# EasyEDA Pro project ProPrj_智能车主控V5.0-20251108_2026-08-26.epro, board PCB2_1
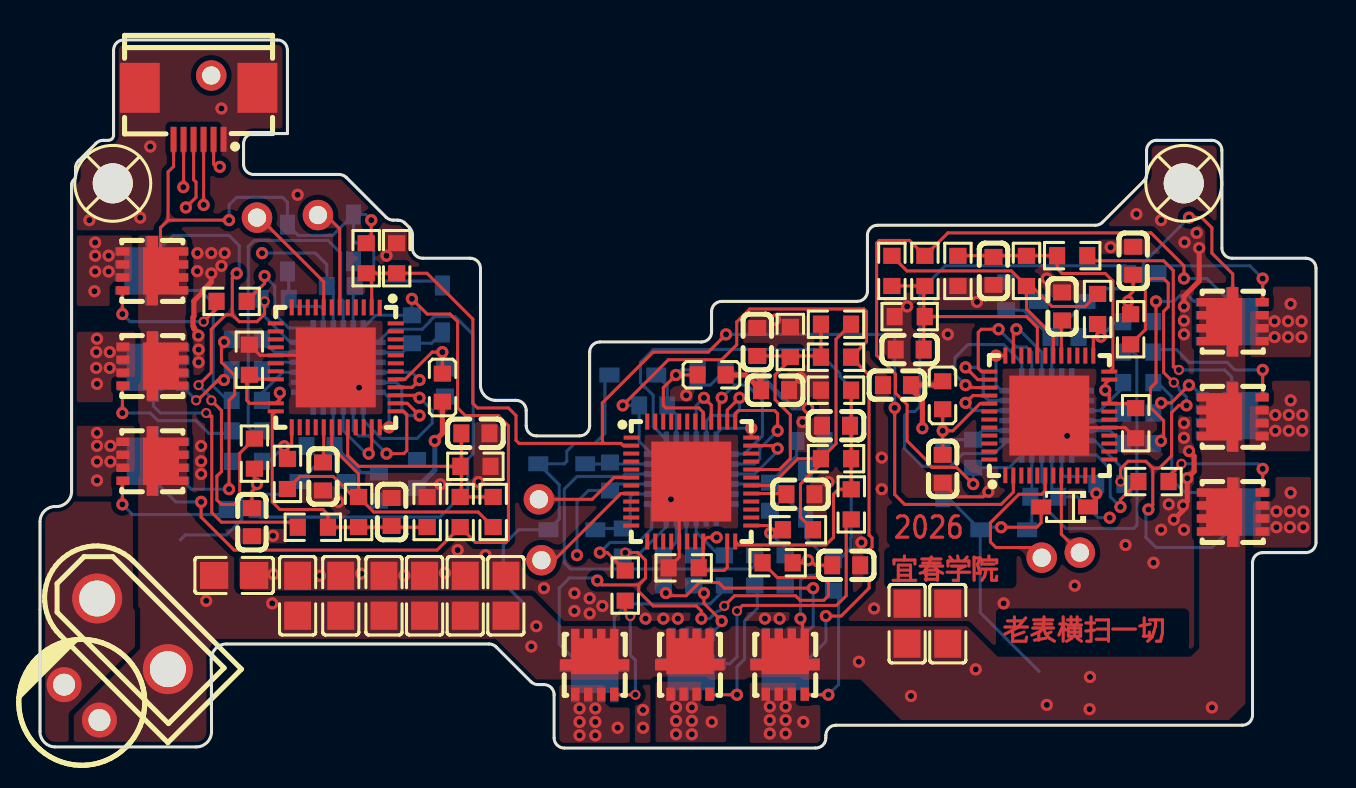
[diagram p7: board, top side]
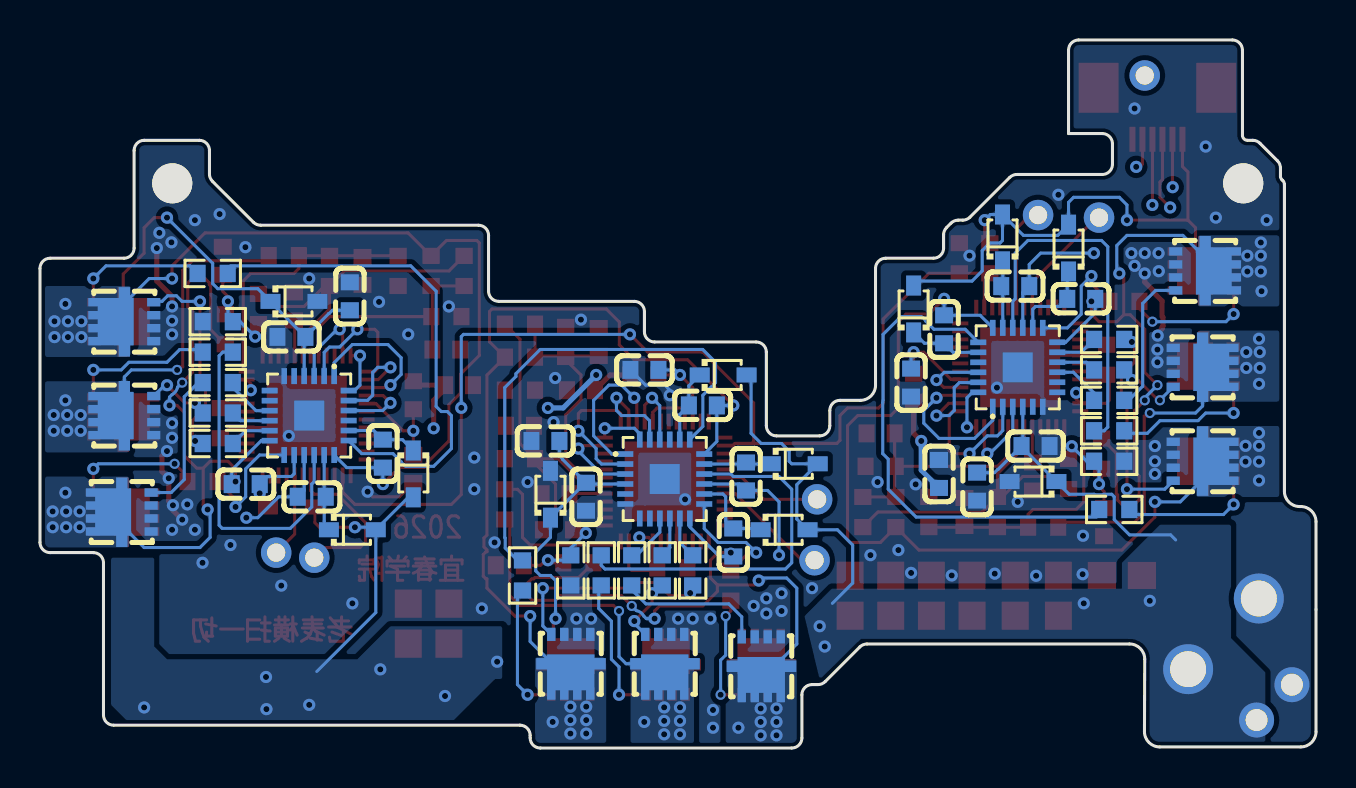
[diagram p8: board, bottom side, seen from below]

Outline 63.81 x 35.43 mm; copper layers: Top Layer, Inner1, Inner2, Bottom Layer. Coordinates in mm from the lower left corner of the outline.
Outline path: 0,11.32 0,0.82 arc(0.22,0.28) 0.76,0.06 7.82,0.06 arc(8.35,0.28) 8.58,0.82 8.56,4.45 arc(8.79,4.98) 9.33,5.21 22.45,5.21 arc(22.65,5.17) 22.81,5.06 24.54,3.32 arc(24.71,3.21) 24.9,3.17 25.2,3.17 arc(25.56,3.03) 25.71,2.67 25.71,0.51 arc(25.86,0.15) 26.22,0 38.79,0 arc(39.15,0.15) 39.3,0.51 39.3,0.64 arc(39.45,0.99) 39.81,1.14 60.13,1.14 arc(60.49,1.29) 60.63,1.65 60.63,9.27 arc(60.78,9.63) 61.14,9.78 63.3,9.78 arc(63.66,9.93) 63.81,10.29 63.81,24 arc(63.66,24.36) 63.3,24.51 59.61,24.51 arc(59.25,24.66) 59.1,25.02 59.1,29.9 arc(58.95,30.26) 58.6,30.41 55.84,30.41 arc(55.48,30.26) 55.33,29.9 55.33,28.72 arc(55.3,28.53) 55.19,28.36 53.13,26.31 arc(52.97,26.2) 52.77,26.16 41.89,26.16 arc(41.53,26.01) 41.38,25.65 41.38,22.86 arc(41.23,22.5) 40.87,22.35 34.09,22.35 arc(33.73,22.2) 33.58,21.84 33.58,20.83 arc(33.43,20.47) 33.08,20.32 28,20.32 arc(27.64,20.17) 27.49,19.81 27.49,16.13 arc(27.34,15.77) 26.98,15.62 24.82,15.62 arc(24.46,15.77) 24.31,16.13 24.31,16.89 arc(24.16,17.25) 23.8,17.4 22.79,17.4 arc(22.25,17.62) 22.03,18.16 22.03,24 arc(21.88,24.36) 21.52,24.51 19.13,24.51 arc(18.77,24.66) 18.62,25.02 18.62,25.69 arc(18.58,25.88) 18.47,26.05 18.25,26.27 arc(18.09,26.38) 17.89,26.42 17.67,26.42 arc(17.47,26.45) 17.31,26.56 15.32,28.55 arc(15.15,28.66) 14.96,28.7 10.69,28.7 arc(10.33,28.85) 10.18,29.21 10.18,30.24 arc(10.33,30.6) 10.69,30.75 12.37,30.75 12.37,34.92 arc(12.23,35.28) 11.87,35.43 4.19,35.43 arc(3.83,35.28) 3.68,34.92 3.68,30.67 arc(3.6,30.49) 3.42,30.41 3.16,30.41 arc(2.97,30.37) 2.8,30.26 1.93,29.39 arc(1.82,29.22) 1.78,29.03 1.78,28.62 arc(1.76,28.52) 1.7,28.44 1.65,28.39 arc(1.6,28.3) 1.58,28.21 1.58,12.85 arc(1.36,12.31) 0.82,12.09 0.76,12.09 arc(0.22,11.86) 0,11.32
Stack: Top Layer 0.035mm Outer layer thickness 1oz / Dielectric1 0.2104mm 7628 RC49% 8.6mil / Inner1 0.0152mm Inner layer thickness / Dielectric2 1.065mm 1.1mm H/HOZ Copper / Inner2 0.0152mm Inner layer thickness / Dielectric3 0.2104mm 7628 RC49% 8.6mil / Bottom Layer 0.035mm Outer layer thickness 1oz

## Design rules (mm)
spacing copperThickness1oz (default): track to track 0.102, other pairs 0.152 to 0.3
spacing copperThickness2oz: track to track 0.203, other pairs 0.152 to 0.3
track width copperThickness1oz (default): min 0.127, default 0.254, max 2.54
track width copperThickness2oz: min 0.203, default 0.254, max 2.54
differential pair differentialPair (default): width min 0.127, default 0.254, max 2.54; gap min 0.152, default 0.152
net VS13 uses copperRegion
net GND uses copperRegion
net VIN uses copperRegion

## Placement (name value [footprint] x y rotation side)
C1  100nF  [C0603]  14.15 13.59 270 top
C2  100nF  [C0603]  21.77 15.75 180 top
C3  100nF  [C0603]  20.25 18.29 90 bottom
C4  100nF  [C0603]  45.14 13.97 90 top
C5  100nF  [C0603]  17.58 11.81 270 top
C6  100nF  [C0603]  10.6 11.3 90 top
C7  100nF  [C0603]  43.49 19.94 0 top
C8  100nF  [C0603]  51.11 22.1 90 top
C9  10uF  [C0603]  16.95 13.08 90 bottom
C10  100nF  [C0603]  14.03 15.11 0 bottom
C11  10uF  [C0603]  18.6 20.95 90 bottom
C12  10uF  [C0603]  15.04 23.11 180 bottom
C13  10uF  [C0603]  11.74 22.48 180 bottom
C14  100nF  [C0603]  47.68 23.88 90 top
C15  100nF  [C0603]  54.67 24.38 270 top
C16  10uF  [C0603]  48.32 22.61 270 bottom
C17  100nF  [C0603]  51.24 20.57 180 bottom
C18  10uF  [C0603]  46.66 14.73 270 bottom
C19  10uF  [C0603]  50.22 12.57 0 bottom
C20  10uF  [C0603]  53.52 13.21 0 bottom
C21  100nF  [C0603]  33.58 18.92 180 bottom
C22  100nF  [C0603]  35.87 20.32 270 top
C23  100nF  [C0603]  38.03 12.7 0 top
C24  100nF  [C0603]  39.81 16.13 0 top
C25  100nF  [C0603]  40.31 9.14 180 top
C26  10uF  [C0603]  38.54 15.37 180 bottom
C27  100nF  [C0603]  36.5 12.57 90 bottom
C28  10uF  [C0603]  30.66 17.14 180 bottom
C29  10uF  [C0603]  28.5 13.59 270 bottom
C30  10uF  [C0603]  29.14 10.29 270 bottom
C31  22uF  [C0805]  19.23 7.62 270 top
C32  22uF  [C0805]  15.04 7.62 270 top
C33  22uF  [C0805]  23.3 7.62 270 top
C34  22uF  [C0805]  43.36 6.22 270 top
C35  22uF  [C0805]  17.2 7.62 270 top
C36  22uF  [C0805]  12.88 7.62 270 top
C37  22uF  [C0805]  9.71 8.64 180 top
C38  22uF  [C0805]  21.26 7.62 270 top
C39  22uF  [C0805]  45.39 6.22 270 top
C41  470uF  [CAP-TH_BD6.3-P2.50-D0.6-FD]  2.09 2.29 135 top
C42  1uF  [C0603]  18.85 13.72 90 bottom
C44  1uF  [C0603]  42.85 18.16 0 top
C45  1uF  [C0603]  36.76 17.91 180 top
CN1  XT30UPB-M  [CONN-TH_XT30UPB-M]  4.63 5.72 315 top
D1  CESD12VD3 ZC  [SOD-323_L1.8-W1.3-LS2.5-RD]  14.15 13.34 0 bottom
D2  B5819WS  [SOD-323_L1.8-W1.3-LS2.5-RD]  20.12 21.97 90 bottom
D3  B5819WS  [SOD-323_L1.8-W1.3-LS2.5-RD]  15.68 25.53 90 bottom
D4  B5819WS  [SOD-323_L1.8-W1.3-LS2.5-RD]  12.37 25.02 90 bottom
D6  CESD12VD3 ZC  [SOD-323_L1.8-W1.3-LS2.5-RD]  51.11 22.35 180 bottom
D7  B5819WS  [SOD-323_L1.8-W1.3-LS2.5-RD]  45.14 13.72 270 bottom
D8  B5819WS  [SOD-323_L1.8-W1.3-LS2.5-RD]  48.19 10.92 180 bottom
D9  B5819WS  [SOD-323_L1.8-W1.3-LS2.5-RD]  51.24 12.06 180 top
D11  CESD12VD3 ZC  [SOD-323_L1.8-W1.3-LS2.5-RD]  38.28 12.7 90 bottom
D12  B5819WS  [SOD-323_L1.8-W1.3-LS2.5-RD]  29.65 18.67 180 bottom
D13  B5819WS  [SOD-323_L1.8-W1.3-LS2.5-RD]  26.09 14.22 180 bottom
D14  B5819WS  [SOD-323_L1.8-W1.3-LS2.5-RD]  26.6 10.92 180 bottom
FPC1  FPC-05F-6PH20  [FPC-SMD_6P-P0.50_XUNPU_FPC-05F-6PH20]  7.93 31.75 180 top
L1  BLM18EG221SN1D  [L0603]  20.12 18.03 270 top
L2  BLM18EG221SN1D  [L0603]  45.14 17.65 90 top
L3  BLM18EG221SN1D  [L0603]  33.58 18.67 0 top
NOREF  -  [Pad_e715]  13.9 26.67 0 top
NOREF#2  -  [Pad_e1759]  8.56 33.66 0 top
NOREF#3  -  [Pad_e714]  10.85 26.54 0 top
NOREF#4  -  [Pad_e1275]  25.07 9.4 90 top
NOREF#5  -  [Pad_e1276]  24.95 12.45 90 top
NOREF#6  -  [Pad_e968]  50.09 9.53 180 top
NOREF#7  -  [Pad_e1506]  52 9.78 180 top
Q1  NVTFS4C05NWFTAG  [WDFN-5_L3.3-W3.3-P0.65-BL]  4.88 14.35 270 top
Q2  NVTFS4C05NWFTAG  [WDFN-5_L3.3-W3.3-P0.65-BL]  4.88 19.11 270 top
Q3  NVTFS4C05NWFTAG  [WDFN-5_L3.3-W3.3-P0.65-BL]  4.88 23.88 270 top
Q4  NVTFS4C05NWFTAG  [WDFN-5_L3.3-W3.3-P0.65-BL]  6.41 14.35 270 bottom
Q5  NVTFS4C05NWFTAG  [WDFN-5_L3.3-W3.3-P0.65-BL]  6.41 19.05 270 bottom
Q6  NVTFS4C05NWFTAG  [WDFN-5_L3.3-W3.3-P0.65-BL]  6.28 23.88 270 bottom
Q7  NVTFS4C05NWFTAG  [WDFN-5_L3.3-W3.3-P0.65-BL]  60.38 21.34 90 top
Q8  NVTFS4C05NWFTAG  [WDFN-5_L3.3-W3.3-P0.65-BL]  60.38 16.57 90 top
Q9  NVTFS4C05NWFTAG  [WDFN-5_L3.3-W3.3-P0.65-BL]  60.38 11.81 90 top
Q10  NVTFS4C05NWFTAG  [WDFN-5_L3.3-W3.3-P0.65-BL]  58.86 21.34 90 bottom
Q11  NVTFS4C05NWFTAG  [WDFN-5_L3.3-W3.3-P0.65-BL]  58.86 16.64 90 bottom
Q12  NVTFS4C05NWFTAG  [WDFN-5_L3.3-W3.3-P0.65-BL]  58.98 11.81 90 bottom
Q13  NVTFS4C05NWFTAG  [WDFN-5_L3.3-W3.3-P0.65-BL]  37.27 3.43 0 top
Q14  NVTFS4C05NWFTAG  [WDFN-5_L3.3-W3.3-P0.65-BL]  32.5 3.43 0 top
Q15  NVTFS4C05NWFTAG  [WDFN-5_L3.3-W3.3-P0.65-BL]  27.74 3.43 0 top
Q16  NVTFS4C05NWFTAG  [WDFN-5_L3.3-W3.3-P0.65-BL]  37.27 4.95 0 bottom
Q17  NVTFS4C05NWFTAG  [WDFN-5_L3.3-W3.3-P0.65-BL]  32.57 4.95 0 bottom
Q18  NVTFS4C05NWFTAG  [WDFN-5_L3.3-W3.3-P0.65-BL]  27.74 4.83 0 bottom
R1  10K  [R0603]  10.47 19.43 270 top
R2  1kΩ  [R0603]  19.36 11.81 270 top
R3  1kΩ  [R0603]  10.34 14.35 0 bottom
R4  5.1kΩ  [R0603]  21.01 11.81 270 top
R5  1kΩ  [R0603]  22.66 11.81 270 top
R6  5.1kΩ  [R0603]  13.64 11.05 180 top
R7  1kΩ  [R0603]  15.93 11.81 90 top
R8  5.1kΩ  [R0603]  10.72 14.73 90 top
R9  1kΩ  [R0603]  12.37 13.72 270 top
R10  1kΩ  [R0603]  21.77 14.1 180 top
R11  10kΩ  [R0603]  17.84 24.51 270 top
R12  47kΩ  [R0603]  16.31 24.51 90 top
R13  10K  [R0603]  54.79 16.26 90 top
R14  4.7Ω  [R0603]  10.09 11.94 180 bottom
R15  4.7Ω  [R0603]  10.34 15.88 180 bottom
R16  4.7Ω  [R0603]  9.58 22.35 180 top
R17  4.7Ω  [R0603]  10.34 17.4 180 bottom
R18  4.7Ω  [R0603]  10.34 18.92 180 bottom
R19  4.7Ω  [R0603]  10.34 20.45 180 bottom
R20  1kΩ  [R0603]  45.9 23.88 90 top
R21  1kΩ  [R0603]  54.92 21.34 180 bottom
R22  5.1kΩ  [R0603]  44.25 23.88 90 top
R23  1kΩ  [R0603]  42.6 23.88 90 top
R24  5.1kΩ  [R0603]  51.62 24.64 0 top
R25  1kΩ  [R0603]  49.33 23.88 270 top
R26  5.1kΩ  [R0603]  54.54 20.95 270 top
R27  1kΩ  [R0603]  52.89 21.97 90 top
R28  1kΩ  [R0603]  43.49 21.59 0 top
R29  10K  [R0603]  32.19 9.02 0 top
R30  1kΩ  [R0603]  39.81 17.91 0 top
R31  4.7Ω  [R0603]  55.17 23.75 0 bottom
R32  4.7Ω  [R0603]  54.92 19.81 0 bottom
R33  4.7Ω  [R0603]  55.68 13.34 0 top
R34  4.7Ω  [R0603]  54.92 18.29 0 bottom
R35  4.7Ω  [R0603]  54.92 16.76 0 bottom
R36  4.7Ω  [R0603]  54.92 15.24 0 bottom
R37  1kΩ  [R0603]  37.27 8.89 90 bottom
R38  5.1kΩ  [R0603]  39.81 19.56 0 top
R39  1kΩ  [R0603]  39.81 21.21 0 top
R40  5.1kΩ  [R0603]  40.57 12.19 270 top
R41  1kΩ  [R0603]  39.81 14.48 180 top
R42  5.1kΩ  [R0603]  36.89 9.27 180 top
R43  1kΩ  [R0603]  37.9 10.92 0 top
R44  1kΩ  [R0603]  37.52 20.32 270 top
R45  4.7Ω  [R0603]  39.68 8.64 270 bottom
R46  4.7Ω  [R0603]  35.74 8.89 270 bottom
R47  4.7Ω  [R0603]  29.27 8.13 270 top
R48  4.7Ω  [R0603]  34.22 8.89 270 bottom
R49  4.7Ω  [R0603]  32.69 8.89 270 bottom
R50  4.7Ω  [R0603]  31.17 8.89 270 bottom
SCREW1  -  [M2螺丝]  3.64 28.26 0 top
SCREW2  -  [M2螺丝]  57.2 28.26 0 top
U1  AI8051U-34K64-QFN48  [UQFN-48_L6.0-W6.0-P0.40-BL-EP4.4]  14.79 19.05 180 top
U2  FD6288Q  [QFN-24_L4.0-W4.0-P0.50-BL-EP2.6]  14.91 19.05 180 bottom
U3  AI8051U-34K64-QFN48  [UQFN-48_L6.0-W6.0-P0.40-BL-EP4.4]  50.47 16.64 0 top
U4  FD6288Q  [QFN-24_L4.0-W4.0-P0.50-BL-EP2.6]  50.35 16.64 0 bottom
U5  AI8051U-34K64-QFN48  [UQFN-48_L6.0-W6.0-P0.40-BL-EP4.4]  32.57 13.34 270 top
U6  FD6288Q  [QFN-24_L4.0-W4.0-P0.50-BL-EP2.6]  32.57 13.46 270 bottom

## Footprints (pads in the part's own frame, mm; a bottom-side part is the same pattern mirrored in y, then rotated)
C0603
  rect 0.8x0.9 smd: 1(-0.7,0) 2(0.7,0)
C0805
  rect 1.41x1.35 smd: 1(-1,0) 2(1,0)
CAP-TH_BD6.3-P2.50-D0.6-FD
  round 1.75 hole 1.1: 1(-1.25,0) 2(1.25,0)
CONN-TH_XT30UPB-M
  round 2.5 hole 1.8: 1(-2.5,0) 2(2.5,0)
FPC-SMD_6P-P0.50_XUNPU_FPC-05F-6PH20
  rect 0.3x1.25 smd: 1(-1.25,1.288) 2(-0.75,1.288) 3(-0.25,1.288) 4(0.25,1.288) 5(0.75,1.288) 6(1.25,1.288)
  rect 2x2.5 smd: 7(2.94,-1.288) 8(-2.94,-1.288)
L0603
  rect 0.8x0.864 smd: 1(-0.7,0) 2(0.7,0)
M2螺丝
  round 2 hole 2: 1(0,0)
Pad_e714
  round 1.524 hole 0.914: 1(0,0)
Pad_e715
  round 1.524 hole 0.914: 2(0,0)
Pad_e968
  round 1.524 hole 0.914: 2(0,0)
Pad_e1275
  round 1.524 hole 0.914: 1(0,0)
Pad_e1276
  round 1.524 hole 0.914: 2(0,0)
Pad_e1506
  round 1.524 hole 0.914: 2(0,0)
Pad_e1759
  round 1.524 hole 0.914: 1(0,0)
QFN-24_L4.0-W4.0-P0.50-BL-EP2.6
  rect 0.28x0.8 smd: 1(-1.25,-1.975) 2(-0.75,-1.975) 3(-0.25,-1.975) 4(0.25,-1.975) 5(0.75,-1.975) 6(1.25,-1.975) 13(1.25,1.975) 14(0.75,1.975) 15(0.25,1.975) 16(-0.25,1.975) 17(-0.75,1.975) 18(-1.25,1.975)
  rect 0.8x0.28 smd: 7(1.975,-1.25) 8(1.975,-0.745) 9(1.975,-0.245) 10(1.975,0.255) 11(1.975,0.755) 12(1.975,1.255) 19(-1.975,1.25) 20(-1.975,0.75) 21(-1.975,0.25) 22(-1.975,-0.25) 23(-1.975,-0.75) 24(-1.975,-1.25)
  rect 1.5x1.5 smd: 25(0,0)
R0603
  rect 0.806x0.864 smd: 1(-0.753,0) 2(0.753,0)
SOD-323_L1.8-W1.3-LS2.5-RD
  rect 1x0.75 smd: 1(-1.173,0) 2(1.173,0)
UQFN-48_L6.0-W6.0-P0.40-BL-EP4.4
  rect 0.2x0.8 smd: 1(-2.2,-2.981) 2(-1.8,-3) 3(-1.4,-3) 4(-1,-3) 5(-0.6,-3) 6(-0.2,-3) 7(0.2,-3) 8(0.6,-3) 9(1,-3) 10(1.4,-3) 11(1.8,-3) 12(2.2,-3) 25(2.2,3) 26(1.8,3) 27(1.4,3) 28(1,3) 29(0.6,3) 30(0.2,3) 31(-0.2,3) 32(-0.6,3) 33(-1,3) 34(-1.4,3) 35(-1.8,3) 36(-2.2,3)
  rect 0.8x0.2 smd: 13(3,-2.199) 14(3,-1.8) 15(3,-1.4) 16(3,-1) 17(3,-0.6) 18(3,-0.2) 19(3,0.2) 20(3,0.6) 23(3,1.8) 24(3,2.2) 37(-3,2.2) 38(-3,1.8) 39(-3,1.4) 40(-3,1) 41(-3,0.6) 42(-3,0.2) 43(-3,-0.2) 44(-3,-0.6) 45(-3,-1) 46(-3,-1.4) 47(-3,-1.8) 48(-3,-2.199)
  rect 4x4 smd: 49(-0.002,0.002)
WDFN-5_L3.3-W3.3-P0.65-BL
  rect 0.42x0.66 smd: 1(-0.975,-0.735) 2(-0.325,-0.735) 3(0.325,-0.735) 4(0.975,-0.735)
  custom 3.48x2.265 smd: 5(0,0.735)

## Nets
As in the schematic, except:
VCC_5V: C42.1 C44.2 C45.2 FPC1.2 L1.2 L2.2 L3.2 NOREF#2.1
RX1: NOREF.2 U1.6
RX2: NOREF#6.2 U3.6
RX3: NOREF#5.2 U5.6
TX1: NOREF#3.1 U1.8
TX2: NOREF#7.2 U3.8
TX3: NOREF#4.1 U5.8

Pads without a net: U1 1 3 4 5 7 9 10 11 12 13 14 15 16 18 19 26 27 28 31 33 34 42 43 44 45 46 47 48; U2 5 7 8 21; U3 1 3 4 5 7 9 10 11 12 13 14 15 16 18 19 26 27 28 31 33 34 42 43 44 45 46 47 48; U4 5 7 8 21; U5 1 3 4 5 7 9 10 11 12 13 14 15 16 18 19 26 27 28 31 33 34 42 43 44 45 46 47 48; U6 5 7 8 21

## Via types
v1: diameter 0.61, hole 0.305, Top Layer to Bottom Layer, 234 vias
v2: diameter 0.508, hole 0.305, Top Layer to Bottom Layer, 15 vias

## Routing (per net, layer and track width the routed paths; a pad name or vN(x,y) marks a point on that pad's centre or on a via; arc(x,y) is an arc through that point)
GND: length 30.5
  Top Layer w0.152: U1.49 14.19,19.65 11,19.65 R1.1 ; U3.49 51.07,16.04 U3.17 54.26,16.04 R13.1 ; R29.1 31.97,9.55 U5.17 31.97,12.73 U5.49 ; C4.1 45.84,12.57 47.17,12.57 v1(47.43,12.83)
  Top Layer w0.254: v1(56.7,11.43) 57.16,11.89 v1(57.16,12.15) 57.37,12.36 v1(57.37,13.5) 57.71,13.84 57.71,14.61 v1(57.46,14.86) ; v1(57.21,22.1) 57.21,22.61 57.97,23.37 v1(57.97,25.02) ; v1(7.92,20.64) 7.92,20.77 7.7,20.99 7.7,21.07 7.65,21.12 7.65,21.56 7.7,21.6 7.7,22.37 8.14,22.82 8.14,22.9 8.56,23.32 v1(8.56,23.75)
  Bottom Layer w0.152: v1(32.31,17.65) 32.31,17.91 32.57,18.16 33.52,18.16 C21.1
  vias: v1(2.47,26.42) v1(5.01,26.54) v1(5.52,30.1) v1(7.87,24.77) v1(7.86,23.86) v1(7.93,19.94) v1(7.93,19.3) v1(8.06,15.11) v1(8.06,14.35) v1(8.06,13.72) v1(8.56,24.77) v1(9.07,32) v1(9.07,24.13) v1(9.23,24.77) v1(11.65,10.62) v1(11.67,8.7) v1(12.88,27.69) v1(14,8.62) v1(14.91,12.32) v1(15.96,18.03) v1(16.06,8.73) v1(17.33,24.64) v1(18.22,8.64) v1(20.02,13.2) v1(20.25,8.76) v1(20.88,9.91) v1(21.92,13.31) v1(22.28,9.65) v1(25.2,8) v1(26.73,7.75) v1(26.73,6.86) v1(27.49,7.49) v1(27.49,6.73) v1(28.12,7.11) v1(30.15,1.91) v1(30.15,1.02) v1(30.28,6.48) v1(31.17,6.48) v1(31.55,12.45) v1(31.9,6.48) v1(36.25,6.48) v1(36.76,21.44) v1(36.98,6.48) v1(38.05,18.52) v1(38.13,16.31) v1(39.43,13.31) v1(41.08,10.29) v1(41.71,6.98) v1(42.09,14.53) v1(42.09,12.95) v1(43.36,22.1) v1(45.39,20.7) v1(46.85,22.33) v1(48.19,7.24) v1(50.35,23.5) v1(51.36,15.62) v1(51.74,8.13) v1(53.54,25.06) v1(54.28,10.16) v1(54.83,26.72) v1(55.68,9.27) v1(56.06,26.42) v1(56.06,10.92) v1(56.44,12.19) v1(57.23,25.31) v1(57.21,21.38) v1(57.21,20.7) v1(57.21,16.26) v1(57.21,15.53) v1(57.21,10.92) v1(57.84,25.78)
VBATADC: length 54.9
  Top Layer w0.152: v1(42.74,17.02) 42.74,12.69 43.24,12.19 48.06,12.19 48.67,12.81 U3.2 ; 16.59,22.05 16.59,23.61 16.44,23.76 19.35,23.76 21.65,21.46 21.65,17.25 21.88,17.02 23.42,17.02 23.8,16.64 23.8,15.4 23.96,15.25 28.21,15.25 ; 28.21,15.25 28.12,15.34 28.12,17.27 30.66,19.81 33.42,19.81 v1(34.31,20.7) ; 28.21,15.25 29.05,15.25 29.16,15.14 U5.2
  Bottom Layer w0.152: v1(42.74,17.02) 42.74,20.59 42.63,20.7 v1(34.31,20.7)
VCC_5V: length 16.2
  Top Layer w0.152: FPC1.2 8.68,29.22 8.82,29.08
  Top Layer w0.254: L1.2 20.12,15.75 v1(19.74,15.37) ; 36,17.97 35.3,18.67 L3.2 ; 36,17.97 v1(36,18.67) ; 36,17.97 C45.2 ; v1(44.12,16) 44.12,17.4 43.55,17.97 C44.2 44.95,18.16 L2.2
  Bottom Layer w0.254: v1(36,18.67) 37.65,17.02 v1(38.41,17.02) ; C42.1 19.74,13.91 v1(19.74,15.37)
  vias: v1(8.99,29.08)
VIN: length 111.3
  Top Layer w0.152: 16.44,25.26 16.57,25.39 v1(16.57,26.42) ; v1(9.45,26.42) 6.41,26.42 ; 6.41,26.42 6.41,28.83 6.68,29.1 FPC1.6 ; 6.41,26.42 6.02,26.03 6.02,24.28 Q3.5 ; v1(48.06,11.05) 49.84,11.05 50.06,11.27 D9.2 ; v1(38.03,6.48) 38.14,6.37 38.14,5.48 ; v1(57.46,26.54) 58.09,26.54 58.6,26.03 58.6,24.77 59.65,23.72 59.65,21.34
  Bottom Layer w0.152: C17.2 50.6,20.51 U4.4 ; C17.2 52.28,22.32 D6.1 52.92,22.99 54.92,22.99 55.17,23.24 55.17,24.26 v1(57.46,26.54) ; C17.2 49.36,21.75 49.34,21.75 49.18,21.91 C16.2 ; v1(9.45,26.42) 9.45,27.18 9.83,27.56 12.12,27.56 12.37,27.31 D4.2 12.91,25.65 14.63,25.65 D3.2 ; D3.2 15.68,25.4 15.8,25.27 16.31,25.27 16.69,24.89 16.69,23.88 17.2,23.37 19.9,23.37 D2.2 ; D3.2 16.28,26.7 v1(16.57,26.42) ; C27.2 36.54,13.27 D11.1 38.28,10.54 39.02,9.8 39.02,8.87 38.79,8.64 38.28,8.64 38.03,8.38 v1(38.03,6.48) ; C27.2 36.44,13.21 U6.4 ; C27.2 37.68,14.45 37.68,14.47 37.84,14.62 37.84,15.49 ; D8.2 47.02,6.78 49.97,3.83 ; D8.2 45.39,12.54 D7.2 ; D8.2 47.14,11.05 v1(48.06,11.05) ; D12.2 28.25,18.44 28.25,15.75 27.74,15.24 26.73,15.24 26.34,14.86 26.34,14.35 26.22,14.22 D13.2 25.96,13.18 25.96,11.46 D14.2 23.93,10.92 23.17,10.16 23.17,8.26 24.19,7.24 ; 7.02,10.41 7.27,10.67 9.33,10.67 10.09,11.43 10.09,12.57 10.22,12.7 10.6,12.7 10.63,12.67 11.07,12.67 11.1,12.7 12.35,12.7 D1.1 14.73,15.08 C10.2 ; C10.2 14.66,15.17 U2.4 ; C10.2 15.9,13.94 15.92,13.94 16.08,13.78 C9.2
  vias: v1(8.31,7.37) v1(11.61,7.24) v1(24.57,5.08) v1(24.82,6.1) v1(40.95,4.32) v1(43.55,2.6) v1(46.79,3.94) v1(50.35,2.16) v1(52.49,1.95) v1(52.51,3.56) v1(58.6,2.03)
BMF11: length 12.1
  Top Layer w0.152: U1.32 15.39,14.64 15.93,14.1 R10.2 ; R5.1 R4.1 21.07,12.63 C2.2
BMF12: length 13.3
  Top Layer w0.152: U1.24 11.61,16.67 11.61,12.32 11.99,11.94 14.15,11.94 14.4,11.69 R6.1 19.35,11.05 R2.2
BMF13: length 6.6
  Top Layer w0.152: 10.85,13.09 10.6,12.84 C6.2 ; 10.85,13.09 10.72,13.21 R8.1 ; 10.85,13.09 10.85,13.2 v1(10.85,13.21) ; v1(12.21,15.1) 12.37,14.94 R9.1 ; U1.25 12.59,15.1
  Bottom Layer w0.152: v1(10.85,13.21) 10.85,14.11 R3.2 11.46,14.35 v1(12.21,15.1)
BMF21: length 12.1
  Top Layer w0.152: R23.1 R22.1 44.19,23.06 C7.2 ; U3.32 49.87,21.05 49.33,21.59 R28.2
BMF22: length 13.3
  Top Layer w0.152: U3.24 53.65,19.01 53.65,23.37 53.27,23.75 51.11,23.75 50.86,23.99 R24.1 45.91,24.64 R20.2
BMF23: length 6.6
  Top Layer w0.152: 54.42,22.6 54.54,22.48 R26.1 ; 54.42,22.6 54.42,22.36 v1(54.41,22.35) ; 54.42,22.6 54.67,22.85 C15.2 ; R27.1 52.89,20.75 v1(53.05,20.59) ; U3.25 52.67,20.59
  Bottom Layer w0.152: v1(53.05,20.59) 53.8,21.34 R21.2 54.41,21.58 v1(54.41,22.35)
BMF31: length 12.8
  Top Layer w0.152: R39.1 R38.1 38.99,19.62 C22.2 ; U5.32 36.98,13.94 37.52,14.48 37.52,16.67 36.76,17.43 36.76,18.67 37.52,19.43 R44.2
BMF32: length 13.3
  Top Layer w0.152: U5.24 34.94,10.16 39.3,10.16 39.68,10.54 39.68,12.7 39.92,12.95 R40.1 40.57,17.9 R30.2
BMF33: length 6.6
  Top Layer w0.152: U5.25 36.52,11.13 ; 38.53,9.39 38.41,9.39 v1(38.41,9.4) ; 38.53,9.39 38.78,9.14 C25.2 ; 38.53,9.39 38.41,9.27 R42.1 ; R43.1 36.68,10.92 v1(36.52,10.76)
  Bottom Layer w0.152: v1(38.41,9.4) 37.51,9.4 R37.2 37.27,10.01 v1(36.52,10.76)
EM1_PWM: length 21.1
  Top Layer w0.152: FPC1.3 8.18,27.18 v1(8.18,27.18) ; v1(11.99,17.78) 11.99,17.46 U1.23 10.49,17.25 10.34,17.4 10.34,18.55 R1.2 10.7,18.45 U1.20
  Inner2 w0.152: v1(11.99,17.78) 11.99,25.02 11.61,25.4 8.31,25.4 8.18,25.53 v1(8.18,27.18)
EM2_PWM: length 73.1
  Top Layer w0.152: v1(7.29,27.05) 7.8,27.56 7.8,28.32 7.68,28.44 FPC1.4 ; U3.23 53.27,18.23 v1(53.27,17.91) 53.47,17.7 U3.20 54.57,17.24 R13.2
  Inner2 w0.152: v1(7.29,27.05) 6.79,27.05 6.53,27.31 6.53,28.58 6.79,28.83 7.93,28.83 8.44,28.32 14.66,28.32 15.42,27.56 15.42,14.35 15.93,13.84 52.38,13.84 53.52,14.99 53.52,17.65 v1(53.27,17.91)
EM3_PWM: length 49.9
  Top Layer w0.152: v1(33.84,10.54) 33.37,10.54 U5.20 33.17,9.24 R29.2 33.07,8.89 34.22,8.89 34.37,9.04 34.37,10.34 ; FPC1.5 7.18,28.08 v1(7.17,28.07)
  Inner2 w0.152: v1(33.84,10.54) 14.53,10.54 13.64,11.43 13.64,24.51 12.25,25.91 12.25,27.43 11.87,27.81 7.42,27.81 v1(7.17,28.07)
HO11: length 24.5
  Bottom Layer w0.152: 10.98,11.56 19.99,11.56 21.39,12.95 21.39,14.46 21.67,14.73 21.67,17.3 arc(21.65,17.35) 21.65,17.4 21.65,20.7 20.76,21.59 19.74,21.59 19.68,21.53 19.65,21.53 19.52,21.39 19.52,21.37 19.11,20.95 17.54,20.95 16.89,20.3
HO12: length 18.6
  Bottom Layer w0.152: R15.1 10.6,15.88 10.41,16.06 10.41,25.09 10.72,25.4 14.41,25.4 15.04,24.77 15.04,22.48 15.16,22.36 U2.16
HO13: length 6
  Top Layer w0.152: R16.1 11.23,23.25 v1(11.23,23.62)
  Bottom Layer w0.152: v1(11.23,23.62) 11.74,23.11 11.74,21.72 12.43,21.03 U2.13
HO21: length 25.2
  Bottom Layer w0.152: U4.19 47.72,14.73 46.16,14.73 45.74,14.32 45.74,14.29 45.61,14.16 45.58,14.16 45.52,14.1 44.12,14.1 43.24,14.99 43.24,16.64 43.44,16.84 43.74,16.84 44,17.09 44,22.86 45.27,24.13 54.28,24.13
HO22: length 17
  Bottom Layer w0.152: R32.1 54.67,19.81 54.85,19.63 54.85,11.15 54.7,10.99 51.29,10.99 50.22,12.06 50.22,13.21 50.1,13.33 U4.16
HO23: length 6
  Top Layer w0.152: v1(54.03,12.06) 54.03,12.44 R33.1
  Bottom Layer w0.152: U4.13 52.83,14.66 53.52,13.97 53.52,12.57 v1(54.03,12.06)
HO31: length 24.8
  Bottom Layer w0.152: U6.19 30.66,16.09 30.66,17.65 30.25,18.07 30.22,18.07 30.09,18.2 30.09,18.22 30.03,18.29 30.03,19.3 30.67,19.94 38.8,19.94 40.01,18.73 40.01,18.59 40.57,18.03 40.57,10.53 40.54,10.51 40.54,10.01 40.06,9.53
HO32: length 18.6
  Bottom Layer w0.152: U6.16 29.26,13.71 29.14,13.59 26.85,13.59 26.22,12.95 26.22,9.27 26.53,8.96 35.56,8.96 35.74,9.14 R46.1
HO33: length 6
  Top Layer w0.152: R47.1 28.37,9.78 v1(28,9.78)
  Bottom Layer w0.152: U6.13 30.59,10.98 29.9,10.29 28.5,10.29 v1(28,9.78)
LO11: length 2.1
  Bottom Layer w0.152: U2.11 11.74,19.81 R19.1
LO12: length 2
  Bottom Layer w0.152: R18.1 11.48,19.31 U2.10
LO13: length 2.6
  Bottom Layer w0.152: U2.9 12.14,18.81 11.1,17.77 R17.1
LO21: length 2.1
  Bottom Layer w0.152: U4.11 53.52,15.88 R36.1
LO22: length 2
  Bottom Layer w0.152: R35.1 53.78,16.38 U4.10
LO23: length 2.6
  Bottom Layer w0.152: R34.1 54.17,18.04 53.01,16.88 U4.9
LO31: length 2.1
  Bottom Layer w0.152: U6.11 31.81,10.29 R50.1
LO32: length 2
  Bottom Layer w0.152: U6.10 32.31,10.03 R49.1
LO33: length 2.6
  Bottom Layer w0.152: R48.1 33.97,9.64 32.81,10.8 U6.9
MID1: length 15.6
  Top Layer w0.152: R7.2 15.93,13.72 14.59,15.06 14.59,16.05 ; R7.2 16.68,11.81 21.91,11.81 R5.2 ; R7.2 15.68,12.56 14.66,13.59 13,13.59 R9.2
MID2: length 15.6
  Top Layer w0.152: R23.2 43.35,23.88 48.58,23.88 R25.2 ; R25.2 49.58,23.12 50.6,22.1 52.26,22.1 R27.2 ; R25.2 49.33,21.97 50.67,20.63 U3.30
MID3: length 15.6
  Top Layer w0.152: R39.2 39.81,20.46 39.81,15.23 R41.2 ; R41.2 37.9,14.48 36.56,13.14 U5.30 ; R41.2 39.05,14.23 38.03,13.21 38.03,11.55 R43.2
PWM11H: length 3.6
  Top Layer w0.152: U1.40 18.61,18.05 v1(18.98,18.42)
  Bottom Layer w0.152: v1(18.98,18.42) 18.59,18.8 16.89,18.8
PWM11L: length 7.6
  Top Layer w0.152: v1(18.98,17.53) 18.85,17.65 17.79,17.65
  Bottom Layer w0.152: v1(18.98,17.53) 19.61,16.89 19.61,16.26 18.85,15.49 17.07,15.49 16.16,16.4 U2.1
PWM12H: length 4.9
  Top Layer w0.152: U1.38 18.37,17.25 v1(18.98,16.64)
  Bottom Layer w0.152: v1(18.98,16.64) 18.34,16.64 18.09,16.89 18.09,18.03 17.84,18.29 16.9,18.29 16.89,18.3
PWM12L: length 6.8
  Top Layer w0.152: v1(17.33,14.73) 18.19,14.73 18.34,14.88 18.34,16.7 18.19,16.85 U1.37
  Bottom Layer w0.152: v1(17.33,14.73) 16.44,15.62 15.93,15.62 15.66,15.89 U2.2
PWM13H: length 2.6
  Top Layer w0.152: U1.36 v1(17.45,16.05)
  Bottom Layer w0.152: 16.89,17.8 17.18,17.8 17.45,17.53 v1(17.45,16.05)
PWM13L: length 4.3
  Top Layer w0.152: v1(16.44,14.73) 16.59,14.88 16.59,16.05
  Bottom Layer w0.152: U2.3 15.16,15.88 16.31,14.73 v1(16.44,14.73)
PWM21H: length 3.6
  Top Layer w0.152: v1(46.28,17.27) 46.65,17.64 U3.40
  Bottom Layer w0.152: U4.22 46.67,16.89 v1(46.28,17.27)
PWM21L: length 7.5
  Top Layer w0.152: U3.39 46.41,18.04 v1(46.28,18.16)
  Bottom Layer w0.152: v1(46.28,18.16) 45.75,18.69 45.75,19.53 46.41,20.19 48.19,20.19 49.1,19.28 U4.1
PWM22H: length 4.9
  Top Layer w0.152: v1(46.28,19.05) 46.9,18.44 U3.38
  Bottom Layer w0.152: v1(46.28,19.05) 46.92,19.05 47.17,18.8 47.17,17.65 47.43,17.4 48.36,17.4 U4.23
PWM22L: length 6.8
  Top Layer w0.152: U3.37 47.07,18.84 46.92,18.99 46.92,20.8 47.07,20.95 v1(47.93,20.95)
  Bottom Layer w0.152: U4.2 49.6,19.8 49.33,20.07 48.82,20.07 v1(47.93,20.95)
PWM23H: length 2.6
  Top Layer w0.152: U3.36 v1(47.81,19.64)
  Bottom Layer w0.152: U4.24 48.08,17.89 47.81,18.16 v1(47.81,19.64)
PWM23L: length 4.3
  Top Layer w0.152: U3.35 48.67,20.81 v1(48.82,20.95)
  Bottom Layer w0.152: v1(48.82,20.95) 48.95,20.95 50.1,19.81 U4.3
PWM31H: length 3.6
  Top Layer w0.152: v1(33.2,17.53) 33.57,17.16 U5.40
  Bottom Layer w0.152: v1(33.2,17.53) 32.82,17.14 U6.22
PWM31L: length 7.6
  Top Layer w0.152: v1(34.09,17.53) 33.97,17.4 U5.39
  Bottom Layer w0.152: v1(34.09,17.53) 34.73,18.16 35.36,18.16 36.12,17.4 36.12,15.62 35.21,14.71 U6.1
PWM32H: length 4.9
  Top Layer w0.152: 34.37,16.34 34.37,16.91 v1(34.98,17.53)
  Bottom Layer w0.152: U6.23 33.33,15.45 33.33,16.38 33.58,16.64 34.73,16.64 34.98,16.89 v1(34.98,17.53)
PWM32L: length 6.8
  Top Layer w0.152: v1(36.89,15.88) 36.89,16.74 36.73,16.89 34.92,16.89 34.77,16.74 U5.37
  Bottom Layer w0.152: U6.2 35.73,14.21 36,14.48 36,14.99 v1(36.89,15.88)
PWM33H: length 2.6
  Top Layer w0.152: U5.36 v1(35.57,16)
  Bottom Layer w0.152: U6.24 33.82,15.73 34.09,16 v1(35.57,16)
PWM33L: length 4.3
  Top Layer w0.152: U5.35 36.74,15.14 v1(36.89,14.99)
  Bottom Layer w0.152: v1(36.89,14.99) 36.89,14.86 35.74,13.71 U6.3
RX1: length 5.4
  Top Layer w0.152: U1.6 14.99,25.98 13.92,27.05
RX2: length 8
  Top Layer w0.152: U3.6 50.27,12.88 50.09,12.7 48.95,12.7 47.53,11.28 47.53,10.31 47.81,10.03 49.59,10.03 NOREF#6.2
RX3: length 5.1
  Top Layer w0.152: NOREF#5.2 27.61,12.45 28.7,13.53 U5.6
TX1: length 6.5
  Top Layer w0.152: U1.8 14.19,23.33 10.47,27.05
TX2: length 4.2
  Top Layer w0.152: U3.8 51.07,10.7 NOREF#7.2
TX3: length 6.5
  Top Layer w0.152: U5.8 29.05,12.73 25.33,9.02 24.57,9.02
VB11: length 3.6
  Bottom Layer w0.152: D2.1 19.58,20.26 C11.1 18.14,19.8 16.89,19.8
VB12: length 3.3
  Bottom Layer w0.152: U2.17 15.66,24.34 D3.1
VB13: length 4.3
  Bottom Layer w0.152: D4.1 12.44,23.78 C13.1 12.82,22.1 14.03,22.1 14.16,21.96 U2.14
VB21: length 3.6
  Bottom Layer w0.152: U4.20 47.12,15.89 C18.1 45.68,15.43 D7.1
VB22: length 3.3
  Bottom Layer w0.152: U4.17 49.6,11.34 49.59,11.33
VB23: length 4.2
  Top Layer w0.152: D9.1 52.82,12.48 v1(52.82,12.74)
  Bottom Layer w0.152: U4.14 51.1,13.73 51.24,13.59 52.44,13.59 C20.1 ; 52.82,13.21 v1(52.82,12.74)
VB31: length 3.6
  Bottom Layer w0.152: D12.1 31.36,18.13 C28.1 31.82,16.69 U6.20
VB32: length 3.3
  Bottom Layer w0.152: U6.17 27.27,14.21 D13.1
VB33: length 4.3
  Bottom Layer w0.152: D14.1 27.84,10.99 C30.1 29.52,11.37 29.52,12.57 29.66,12.71 U6.14
VS11: length 40.6
  Top Layer w0.152: v1(8.06,12.32) 8.06,11.56 9.71,9.91 19.86,9.91 R4.2 21.78,10.29 23.3,10.29 23.42,10.41 23.42,16.13 22.92,16.64 21.26,16.64 20.88,17.02 20.88,21.34 20.5,21.72 19.36,21.72 v1(18.6,22.48)
  Bottom Layer w0.152: v1(18.6,22.48) C11.2 16.79,21.66 U2.18 ; v1(8.06,12.32) 6.79,12.32 5.67,13.44 Q4.5
  vias: v1(2.85,15.77) v1(2.85,15.12) v1(2.85,14.33) v1(2.85,13.39) v1(3.52,15.12) v1(3.52,14.33)
VS12: length 31.7
  Top Layer w0.152: R6.2 12.64,11.3 9.07,11.3 8.59,11.79 8.59,16.61 8.46,16.61 v2(8.31,16.76)
  Inner2 w0.152: v1(11.1,24.77) 10.85,24.77 10.47,24.38 10.47,17.02 10.22,16.76 v2(8.31,16.76)
  Bottom Layer w0.152: v2(8.31,16.76) 6.02,16.76 5.67,17.12 Q5.5 ; U2.15 14.66,22.79 C12.2 14.34,24.2 13.77,24.77 v1(11.1,24.77)
  vias: v1(2.85,20.48) v1(2.81,19.81) v1(2.81,19.02) v1(2.85,18.22) v1(3.49,19.81) v1(3.49,19.02)
VS13: length 30.5
  Top Layer w0.152: 9.61,21.68 9.61,23.53 v1(9.83,23.75) ; 9.61,21.68 9.96,21.34 10.85,21.34 11.23,21.72 v2(11.23,22.35) ; 9.61,21.68 9.29,21.68 8.56,20.95 8.56,18.8 v2(7.93,18.16) ; R8.2 9.99,14.75 9.99,12.73 9.92,12.66 9.92,12.4 9.71,12.19 9.07,12.19 8.84,12.42 8.84,13.61 9.07,13.83 9.07,16.89 v2(8.56,17.4)
  Bottom Layer w0.152: U2.12 12.52,20.31 11.04,21.78 C13.2 ; Q6.5 5.54,24.54 6.66,25.65 9.45,25.65 9.96,25.15 9.96,23.88 v1(9.83,23.75) ; v2(8.56,17.4) 8.56,17.53 v2(7.93,18.16)
  vias: v1(2.76,25.3) v1(2.76,24.64) v1(2.76,23.85) v1(2.72,22.86) v1(3.43,24.64) v1(3.43,23.85)
VS21: length 39.7
  Top Layer w0.152: v1(46.66,13.21) 45.83,14.04 44.6,14.04 44.46,14.18 44.46,14.27 43.36,15.37 43.36,17.18 42.78,17.76 42.78,18.71 41.84,19.65 41.84,25.27 41.97,25.4 43.48,25.4 R22.2 45.4,25.78 55.55,25.78 57.21,24.13 v1(57.21,23.5)
  Bottom Layer w0.152: Q10.5 59.59,22.25 58.35,23.5 v1(57.21,23.5) ; U4.18 48.47,14.03 C18.2 v1(46.66,13.21)
  vias: v1(61.74,21.36) v1(61.74,20.56) v1(62.41,21.36) v1(62.41,20.56) v1(62.54,22.23) v1(63.09,21.36) v1(63.08,20.56)
VS22: length 30.3
  Top Layer w0.152: v2(56.95,18.92) 56.8,19.08 56.67,19.08 56.67,23.9 56.19,24.38 52.63,24.38 R24.2
  Inner2 w0.152: v1(53.49,11.53) 54.51,11.53 54.79,11.81 54.79,18.67 55.05,18.92 v2(56.95,18.92)
  Bottom Layer w0.152: Q11.5 59.59,18.57 59.24,18.92 v2(56.95,18.92) ; v1(53.49,11.53) 52.92,11.53 51.87,12.57 C19.2 50.6,12.9 U4.15
  vias: v1(61.78,16.67) v1(61.78,15.88) v1(62.45,16.67) v1(62.45,15.88) v1(62.54,17.4) v1(63.12,16.67) v1(63.12,15.88)
VS23: length 30.7
  Top Layer w0.152: 55.65,14 55.65,12.16 v1(55.43,11.94) ; 55.65,14 55.3,14.35 54.41,14.35 54.03,13.97 v2(54.03,13.34) ; 55.65,14 55.97,14 56.59,14.62 56.59,16.78 56.95,17.14 v1(57.33,17.14) ; R26.2 55.28,20.94 55.28,23.12 55.34,23.19 55.34,23.28 55.55,23.5 56.19,23.5 56.42,23.27 56.42,22.08 56.19,21.85 56.19,18.8 v2(56.7,18.29)
  Bottom Layer w0.152: C20.2 54.22,13.91 52.75,15.38 U4.12 ; v1(57.33,17.14) 57.33,17.56 57.21,17.69 arc(57.03,17.84) 56.93,18.05 v2(56.7,18.29) ; v1(55.43,11.94) 55.3,11.81 55.3,10.54 55.81,10.03 58.6,10.03 59.72,11.15 Q12.5
  vias: v1(61.83,11.84) v1(61.83,11.05) v1(62.54,12.78) v1(62.5,11.84) v1(62.5,11.05) v1(63.18,11.84) v1(63.17,11.05)
VS31: length 39.8
  Top Layer w0.152: v1(39.3,6.6) 40.06,6.6 41.46,8 41.46,8.47 41.51,8.47 41.64,8.6 41.64,9.69 41.51,9.82 41.46,9.82 41.46,9.91 41.61,10.07 41.61,10.51 41.46,10.66 41.46,18.66 R38.2 41.33,20.33 41.33,21.84 41.2,21.97 35.49,21.97 34.84,21.32 34.84,20.18 34.09,19.43 31.42,19.43 v1(29.14,17.14)
  Bottom Layer w0.152: U6.18 29.96,15.34 C28.2 v1(29.14,17.14) ; Q16.5 38.18,4.22 39.3,5.33 v1(39.3,6.6)
  vias: v1(36.49,2.07) v1(36.49,1.4) v1(36.49,0.73) v1(37.29,2.07) v1(37.29,1.4) v1(37.29,0.72) v1(38.17,1.31)
VS32: length 31.6
  Top Layer w0.152: v2(34.85,6.86) 35.13,7.14 39.83,7.14 40.31,7.62 40.31,11.18 R40.2
  Inner2 w0.152: v1(26.85,9.65) 26.85,9.4 27.23,9.02 34.6,9.02 34.85,8.76 v2(34.85,6.86)
  Bottom Layer w0.152: v1(26.85,9.65) 26.85,12.32 27.42,12.89 C29.2 28.83,13.21 U6.15 ; Q17.5 34.5,4.22 34.85,4.57 v2(34.85,6.86)
  vias: v1(31.81,2.03) v1(31.81,1.36) v1(31.81,0.69) v1(32.6,2.03) v1(32.6,1.36) v1(32.6,0.69) v1(33.59,1.31)
VS33: length 30.7
  Top Layer w0.152: v1(27.87,8.38) 28.09,8.16 29.93,8.16 ; 29.93,8.16 30.28,8.51 30.28,9.4 29.9,9.78 v2(29.27,9.78) ; 29.93,8.16 29.93,7.84 30.66,7.11 32.82,7.11 33.08,6.86 v1(33.08,6.48) ; v2(34.22,7.11) 34.73,7.62 37.78,7.62 38.01,7.39 39.2,7.39 39.43,7.62 39.43,8.26 39.21,8.47 39.12,8.47 39.05,8.53 36.87,8.53 R42.2
  Bottom Layer w0.152: v1(33.08,6.48) 33.49,6.48 33.62,6.6 arc(33.77,6.78) 33.98,6.88 v2(34.22,7.11) ; v1(27.87,8.38) 27.74,8.51 26.47,8.51 25.96,8 25.96,5.21 27.08,4.09 Q18.5 ; C30.2 29.84,9.59 31.31,11.06 U6.12
  vias: v1(26.98,1.98) v1(26.98,1.31) v1(26.98,0.64) v1(27.77,1.98) v1(27.77,1.31) v1(27.77,0.63) v1(28.88,1.02)
$1N25: length 2
  Top Layer w0.152: 14.15,14.03 14.19,14.07 U1.29
$1N26: length 4.9
  Top Layer w0.152: L1.1 v1(20.12,19.81) 19.61,19.81 18.25,18.45 U1.41
  Bottom Layer w0.152: C3.2 20.25,19.69 v1(20.12,19.81)
$1N98: length 7.3
  Bottom Layer w0.152: R17.2 9.37,17.4 8.67,18.11 8.67,22.25 8.02,22.9 Q6.4
$1N100: length 6.7
  Top Layer w0.152: v1(4.12,21.72) 4.12,22.87 Q3.4 ; v2(8.18,21.34) 8.83,21.98 R16.2
  Bottom Layer w0.152: v2(8.18,21.34) 4.5,21.34 v1(4.12,21.72)
$1N102: length 3.4
  Top Layer w0.152: v2(7.81,17.4) 7.89,17.4 8.9,18.42 v1(9.2,18.42)
  Bottom Layer w0.152: R18.2 9.2,18.53 v1(9.2,18.42) ; v2(7.81,17.4) 7.81,17.41 Q5.4
$1N104: length 7.3
  Top Layer w0.152: Q2.4 4.12,18.11 v1(4.12,16.76)
  Bottom Layer w0.152: R15.2 9.46,15.75 8.44,15.75 7.8,16.38 5.9,16.38 5.52,16.76 v1(4.12,16.76)
$1N106: length 10.7
  Top Layer w0.152: v1(9.21,20.32) 9.07,20.18 9.07,19.3 9.73,18.64 9.73,17.68 9.45,17.4 v1(9.45,12.95)
  Bottom Layer w0.152: Q4.4 7.56,12.95 v1(9.45,12.95) ; v1(9.21,20.32) 9.46,20.32 R19.2
$1N108: length 6.7
  Top Layer w0.152: v1(4.12,12.19) 4.12,13.35 Q1.4
  Bottom Layer w0.152: v1(4.12,12.19) 4.63,11.68 9.08,11.68 R14.2
$2N27: length 2
  Top Layer w0.152: U3.29 51.07,21.62 51.11,21.65
$2N28: length 5.2
  Top Layer w0.152: U3.41 47.01,17.24 45.65,15.88 v1(45.14,15.88) ; L2.1 v1(45.14,15.88) ; v1(45.14,15.88) C4.2
$2N44: length 7.3
  Bottom Layer w0.152: R34.2 55.89,18.29 56.6,17.58 56.6,13.44 57.25,12.79 Q12.4
$2N46: length 6.5
  Top Layer w0.152: v2(57.08,14.22) 56.43,13.58 R33.2 ; v1(61.14,13.97) 61.14,12.81 Q9.4
  Bottom Layer w0.152: v2(57.08,14.22) 60.89,14.22 v1(61.14,13.97)
$2N48: length 3.3
  Top Layer w0.152: v1(57.46,18.16) 56.57,17.27 v1(56.06,17.27)
  Bottom Layer w0.152: v1(57.46,18.16) 57.58,18.16 58.12,17.61 ; R35.2 56.06,17.15 v1(56.06,17.27)
$2N50: length 7.3
  Top Layer w0.152: v1(61.14,18.92) 61.14,17.58 Q8.4
  Bottom Layer w0.152: v1(61.14,18.92) 59.75,18.92 59.36,19.3 57.46,19.3 56.82,19.94 55.8,19.94 R32.2
$2N52: length 10.4
  Top Layer w0.152: v1(56.05,15.37) 56.19,15.5 56.19,16.38 55.53,17.04 55.53,18.01 55.81,18.29 v1(55.81,22.35)
  Bottom Layer w0.152: 58.12,22.31 58.08,22.35 57.71,22.35 57.43,22.63 56.98,22.63 56.71,22.35 v1(55.81,22.35) ; R36.2 55.8,15.37 v1(56.05,15.37)
$2N54: length 6.8
  Top Layer w0.152: Q7.4 61.14,22.34 v1(61.14,23.5)
  Bottom Layer w0.152: v1(61.14,23.5) 60.51,24.13 56.31,24.13 R31.2
$3N19: length 2
  Top Layer w0.152: 37.58,12.7 37.55,12.73 U5.29
$3N20: length 6.7
  Top Layer w0.152: L3.1 v1(31.81,18.67) 31.17,18.03 31.17,17.14 31.3,17.02 32.95,17.02 33.17,16.8 U5.41
  Bottom Layer w0.152: v1(31.81,18.67) 32.06,18.92 C21.2
$3N36: length 7.3
  Bottom Layer w0.152: R48.2 34.22,7.92 33.51,7.21 29.37,7.21 28.72,6.56 Q18.4
$3N38: length 6
  Top Layer w0.152: v2(29.52,6.6) 29.27,6.86 R47.2 ; v2(29.77,2.67) 28.74,2.67 Q15.4
  Bottom Layer w0.152: v2(29.77,2.67) 29.77,4.4 29.52,4.65 v2(29.52,6.6)
$3N40: length 3.3
  Top Layer w0.152: v1(34.09,6.35) 33.2,7.24 v1(33.2,7.75)
  Bottom Layer w0.152: v1(33.2,7.75) 33.08,7.75 R49.2 ; v1(34.09,6.35) 34.09,6.23 Q17.4
$3N42: length 7.3
  Top Layer w0.152: v1(34.85,2.67) 33.51,2.67 Q14.4
  Bottom Layer w0.152: R46.2 35.87,8.01 35.87,6.98 35.23,6.35 35.23,4.45 34.85,4.06 v1(34.85,2.67)
$3N44: length 10.7
  Top Layer w0.152: v1(31.3,7.76) 31.43,7.62 32.31,7.62 32.97,8.28 33.94,8.28 34.22,8 v1(38.66,8)
  Bottom Layer w0.152: v1(38.66,8) 38.66,6.11 Q16.4 ; v1(31.3,7.76) 31.3,8.01 R50.2
$3N46: length 6.7
  Top Layer w0.152: Q13.4 38.27,2.67 v1(39.43,2.67)
  Bottom Layer w0.152: R45.2 39.93,7.63 39.93,3.17 v1(39.43,2.67)

## Copper pours and planes (outline as drawn; the poured copper is in the pictures)
GND on Top Layer: -2.99,36.7 67.49,36.7 67.49,-0.89 -2.99,-0.89
GND on Bottom Layer: -0.83,36.07 67.75,36.07 67.75,-3.17 -0.83,-3.17
GND on Inner1: -1.34,37.72 68.25,37.72 68.25,-0.76 -1.34,-0.76
VCC_5V on Inner2: -0.71,36.32 70.54,36.32 70.54,-1.91 -0.71,-1.91
VIN on Top Layer: 47.88,4.57 57.55,4.57 57.97,4.99 57.97,22.86 58.13,23.02 59.68,23.02 60.28,22.42 60.28,2.22 59.45,1.4 43.07,1.4 41.03,3.43 24.82,3.43 22.79,5.46 6.53,5.46 4.91,7.09 4.91,25.65 7.05,25.65 7.35,25.35 7.35,11.87 9.71,9.52 9.71,7.98 10.06,7.62 24.58,7.62 26.1,6.1 46.35,6.1
VIN on Top Layer: 5.01,7.11 6.97,7.11 8.6,5.48 8.6,0 1.69,0 1.69,1.65 5.01,4.97
VIN on Bottom Layer: 4.53,5.79 9.45,5.79 9.45,0.64 8.87,0.06 2.53,0.06 2.53,3.79
VIN on Bottom Layer: 24.82,3.43 22.74,5.46 4.25,5.46 4.25,11.18 7.8,11.18 9.71,9.27 9.71,7.98 24.21,7.98 25.58,6.6
VIN on Bottom Layer: 40.7,6.1 46.28,6.1 47.93,4.45 57.46,4.45 58.09,5.08 58.09,9.53 60.25,9.53 60.25,2.16 59.49,1.4 43.11,1.4 41.05,3.45 40.7,3.45
VS11 on Top Layer: 1.71,16.13 4.73,16.13 4.73,13.7 3.72,13.7 3.61,13.59 3.61,12.59 1.71,12.59
VS11 on Bottom Layer: 1.67,16.12 5.99,16.12 5.99,12.56 1.67,12.56
VS12 on Top Layer: 1.74,20.84 4.77,20.84 4.77,18.41 3.76,18.41 3.65,18.3 3.65,17.3 1.74,17.3
VS12 on Bottom Layer: 1.58,20.89 5.9,20.89 5.9,17.34 1.58,17.34
VS13 on Top Layer: 1.58,25.65 4.6,25.65 4.6,23.22 3.59,23.22 3.48,23.11 3.48,22.12 1.58,22.12
VS13 on Bottom Layer: 1.58,25.65 5.9,25.65 5.9,22.1 1.58,22.1
VS21 on Top Layer: 63.56,19.56 60.53,19.56 60.53,21.99 61.54,21.99 61.65,22.1 61.65,23.09 63.56,23.09
VS21 on Bottom Layer: 63.59,19.57 59.27,19.57 59.27,23.12 63.59,23.12
VS22 on Top Layer: 63.52,14.85 60.49,14.85 60.49,17.28 61.5,17.28 61.61,17.39 61.61,18.38 63.52,18.38
VS22 on Bottom Layer: 63.68,14.8 59.36,14.8 59.36,18.35 63.68,18.35
VS23 on Top Layer: 63.68,10.03 60.66,10.03 60.66,12.46 61.67,12.46 61.78,12.57 61.78,13.57 63.68,13.57
VS23 on Bottom Layer: 63.68,10.03 59.36,10.03 59.36,13.59 63.68,13.59
VS31 on Top Layer: 35.49,0.25 35.49,3.28 37.92,3.28 37.92,2.27 38.03,2.16 39.02,2.16 39.02,0.25
VS31 on Bottom Layer: 35.5,0.22 35.5,4.54 39.05,4.54 39.05,0.22
VS32 on Top Layer: 30.78,0.29 30.78,3.32 33.21,3.32 33.21,2.31 33.32,2.2 34.31,2.2 34.31,0.29
VS32 on Bottom Layer: 31.11,0.13 31.11,4.45 34.28,4.45 34.28,0.13
VS33 on Top Layer: 25.96,0.13 25.96,3.15 28.39,3.15 28.39,2.14 28.5,2.03 29.5,2.03 29.5,0.13
VS33 on Bottom Layer: 25.96,0.13 25.96,4.45 29.52,4.45 29.52,0.13

Small or netless copper shapes (teardrops, artwork), in the pictures only: 310 on Top Layer, 263 on Bottom Layer, 11 on Inner2

## Text on the board
Top Layer: 2026 | 宜春学院 | 老表横扫一切
